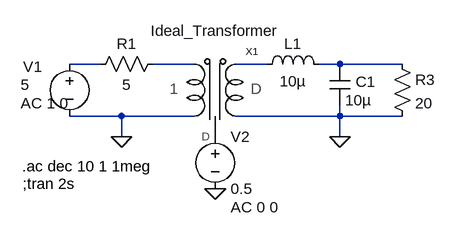
[diagram p0: schematic buck_small_signal.asc]
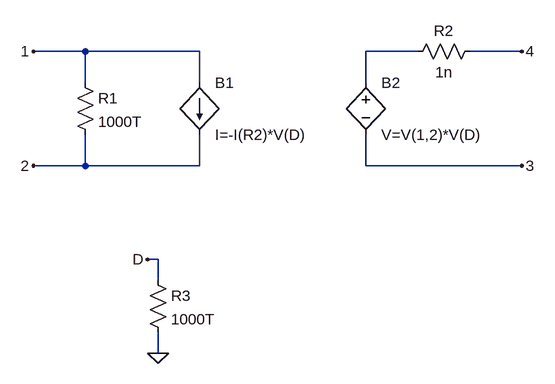
[diagram p1: sub-circuit ideal_transformer.asc]
buck_small_signal.asc, the LTspice schematic file:
Version 4
SHEET 1 880 680
WIRE 32 144 -16 144
WIRE 176 144 112 144
WIRE 288 144 240 144
WIRE 400 144 368 144
WIRE 496 144 400 144
WIRE 400 160 400 144
WIRE 64 224 -16 224
WIRE 176 224 64 224
WIRE 400 224 400 208
WIRE 400 224 240 224
WIRE 496 224 400 224
WIRE 64 256 64 224
WIRE 400 256 400 224
FLAG 64 256 0
FLAG 400 256 0
FLAG 208 336 0
SYMBOL voltage -16 128 R0
WINDOW 0 -71 20 Left 2
WINDOW 3 -75 48 Left 2
WINDOW 123 -75 76 Left 2
WINDOW 39 0 0 Left 0
SYMATTR InstName V1
SYMATTR Value 5
SYMATTR Value2 AC 1 0
SYMBOL res 128 128 R90
WINDOW 0 0 56 VBottom 2
WINDOW 3 32 56 VTop 2
SYMATTR InstName R1
SYMATTR Value 5
SYMBOL res 480 128 R0
SYMATTR InstName R3
SYMATTR Value 20
SYMBOL cap 384 144 R0
WINDOW 0 40 27 Left 2
SYMATTR InstName C1
SYMATTR Value 10µ
SYMBOL ideal_transformer 160 128 R0
WINDOW 3 -51 -35 Left 2
SYMATTR InstName X1
SYMBOL voltage 208 240 R0
WINDOW 123 24 124 Left 2
WINDOW 39 0 0 Left 0
SYMATTR InstName V2
SYMATTR Value 0.5
SYMATTR Value2 AC 0 0
SYMBOL ind 272 160 R270
WINDOW 0 32 56 VTop 2
WINDOW 3 5 56 VBottom 2
SYMATTR InstName L1
SYMATTR Value 10µ
TEXT -88 328 Left 2 !;tran 2s
TEXT -89 301 Left 2 !.ac dec 10 1 1meg

ideal_transformer.asc, the sub-circuit schematic file:
Version 4
SHEET 1 880 680
WIRE -192 80 -272 80
WIRE -16 80 -192 80
WIRE 320 80 240 80
WIRE 480 80 400 80
WIRE -192 128 -192 80
WIRE -16 128 -16 80
WIRE 240 128 240 80
WIRE -192 256 -192 208
WIRE -192 256 -272 256
WIRE -16 256 -16 208
WIRE -16 256 -192 256
WIRE 240 256 240 208
WIRE 480 256 240 256
WIRE -80 400 -96 400
WIRE -80 432 -80 400
WIRE -80 544 -80 512
FLAG -80 544 0
FLAG -96 400 D
FLAG -272 80 1
FLAG -272 256 2
FLAG 480 80 4
FLAG 480 256 3
SYMBOL res -208 112 R0
SYMATTR InstName R1
SYMATTR Value 1000T
SYMBOL res 416 64 R90
WINDOW 0 0 56 VBottom 2
WINDOW 3 32 56 VTop 2
SYMATTR InstName R2
SYMATTR Value 1n
SYMBOL bi -16 128 R0
SYMATTR InstName B1
SYMATTR Value I=-I(R2)*V(D)
SYMBOL res -96 416 R0
SYMATTR InstName R3
SYMATTR Value 1000T
SYMBOL bv 240 112 R0
SYMATTR InstName B2
SYMATTR Value V=V(1,2)*V(D)

The netlist it stands for:
* buck_small_signal.asc
V1 N001 0 5 AC 1 0
R1 N002 N001 5
R3 N004 0 20
C1 N004 0 10µ
XX1 N002 0 0 N003 P001 ideal_transformer params: Ideal_Transformer
V2 P001 0 0.5 AC 0 0
L1 N003 N004 10µ

* block symbol definitions
.subckt ideal_transformer 1 2 3 4 D
R1 1 2 1000T
R2 4 N001 1n
B1 1 2 I=-I(R2)*V(D)
R3 D 0 1000T
B2 N001 3 V=V(1,2)*V(D)
.ends ideal_transformer

;tran 2s
.ac dec 10 1 1meg
.backanno
.end